# EAGLE design dil_module (EAGLE 5.07)
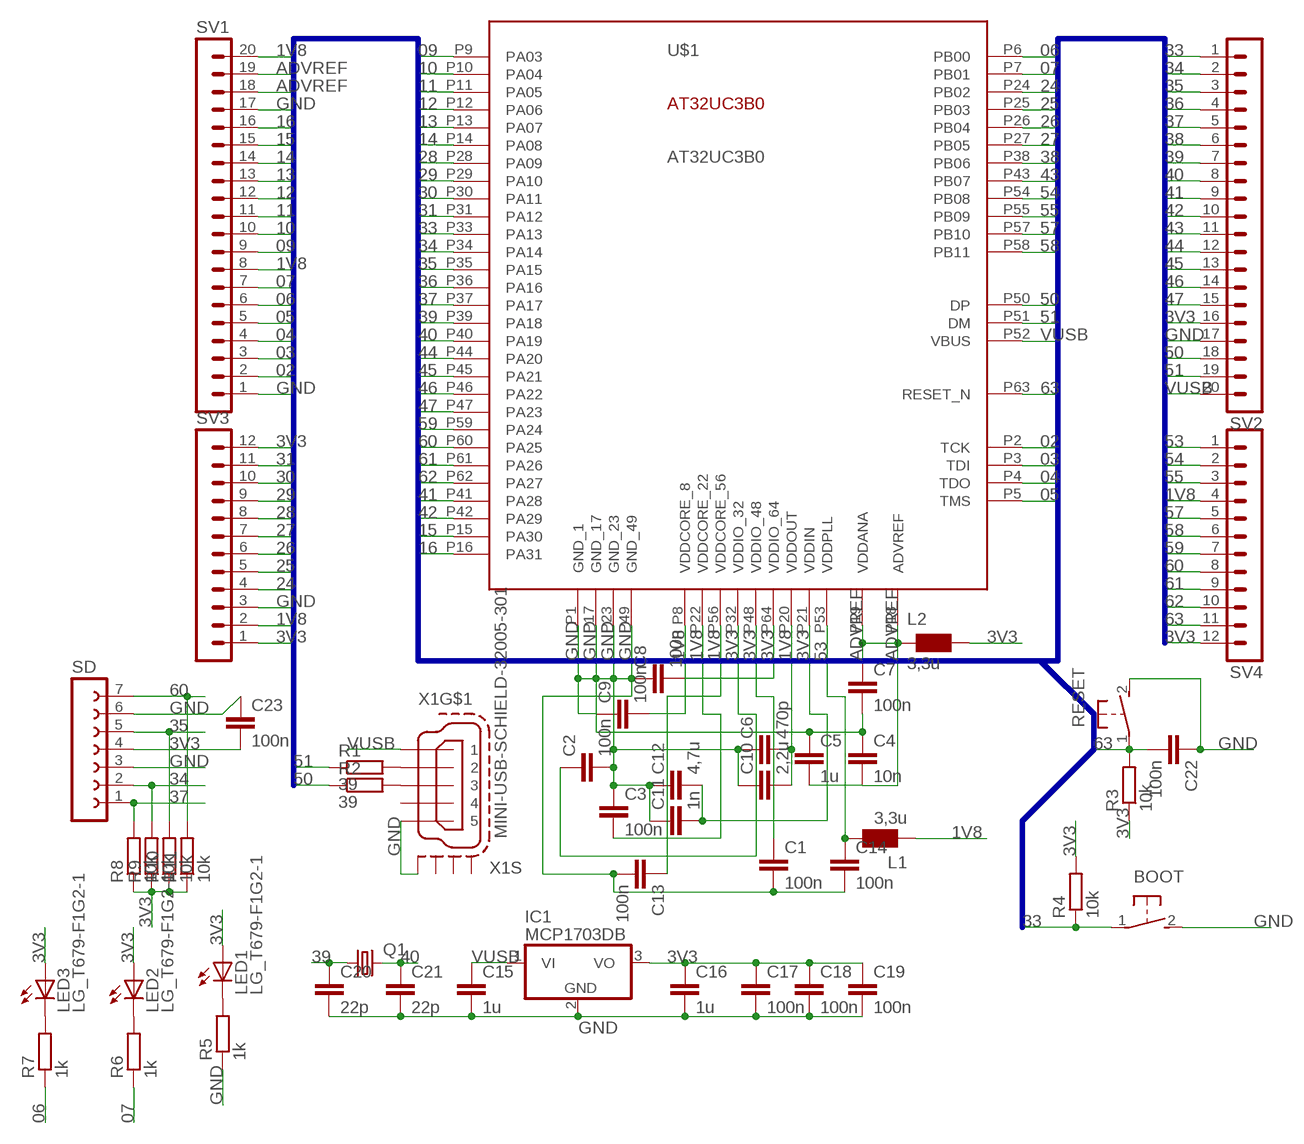
[diagram p0: schematic, sheet 1]

## Parts
BOOT  31-XX  [B3F-31XX]
C1  100n  C-EUC0805  [C0805]
C2  100n  C-EUC0805  [C0805]
C3  100n  C-EUC0805  [C0805]
C4  10n  C-EUC0805  [C0805]
C5  1u  C-EUC0805  [C0805]
C6  470p  C-EUC0805  [C0805]
C7  100n  C-EUC0805  [C0805]
C8  100n  C-EUC0805  [C0805]
C9  100n  C-EUC0805  [C0805]
C10  2,2u  C-EUC1206  [C1206]
C11  1n  C-EUC0805  [C0805]
C12  4,7u  C-EUC1206  [C1206]
C13  100n  C-EUC0805  [C0805]
C14  100n  C-EUC0805  [C0805]
C15  1u  C-EUC0805  [C0805]
C16  1u  C-EUC0805  [C0805]
C17  100n  C-EUC0805  [C0805]
C18  100n  C-EUC0805  [C0805]
C19  100n  C-EUC0805  [C0805]
C20  22p  C-EUC0805  [C0805]
C21  22p  C-EUC0805  [C0805]
C22  100n  C-EUC0805  [C0805]
C23  100n  C-EUC0805  [C0805]
IC1  MCP1703DB  [SOT223]
L1  3,3u  WE-CBF_1206  [1206]
L2  3,3u  WE-CBF_1206  [1206]
LED1  LG_T679-F1G2-1  [PLCC2]
LED2  LG_T679-F1G2-1  [PLCC2]
LED3  LG_T679-F1G2-1  [PLCC2]
Q1  CRYSTALHC49UP  [HC49UP]
R1  39  R-EU_R1206  [R1206]
R2  39  R-EU_R1206  [R1206]
R3  10k  R-EU_R1206  [R1206]
R4  10k  R-EU_R1206  [R1206]
R5  1k  R-EU_R1206  [R1206]
R6  1k  R-EU_R1206  [R1206]
R7  1k  R-EU_R1206  [R1206]
R8  10k  R-EU_R1206  [R1206]
R9  10k  R-EU_R1206  [R1206]
R10  10k  R-EU_R1206  [R1206]
R11  10k  R-EU_R1206  [R1206]
RESET  31-XX  [B3F-31XX]
SD  FE07-1  [FE07]
SV1  MA20-1  [MA20-1]
SV2  MA20-1  [MA20-1]
SV3  MA12-1  [MA12-1]
SV4  MA12-1  [MA12-1]
U$1  AT32UC3B0  [JEDEC_MS-026]
X1  MINI-USB-SCHIELD-32005-301  [32005-301]

## Nets
1V8: C3.2 C6.2 C9.2 C10.2 C13.1 L1.1 SV1.8 SV1.20 SV3.2 SV4.4 U$1.P8(VDDCORE_8) U$1.P20(VDDOUT) U$1.P22(VDDCORE_22) U$1.P56(VDDCORE_56)
02: SV1.2 U$1.P2(TCK)
03: SV1.3 U$1.P3(TDI)
3V3: C1.1 C2.1 C8.2 C11.2 C12.2 C16.1 C17.1 C18.1 C19.1 C23.2 IC1.3(VO) L2.2 LED1.A LED2.A LED3.A R3.1 R4.2 R8.1 R9.1 R10.1 R11.1 SD.4 SV2.16 SV3.1 SV3.12 SV4.12 U$1.P21(VDDIN) U$1.P32(VDDIO_32) U$1.P48(VDDIO_48) U$1.P64(VDDIO_64)
04: SV1.4 U$1.P4(TDO)
05: SV1.5 U$1.P5(TMS)
06: R7.1 SV1.6 U$1.P6(PB00)
07: R6.1 SV1.7 U$1.P7(PB01)
09: SV1.9 U$1.P9(PA03)
10: SV1.10 U$1.P10(PA04)
11: SV1.11 U$1.P11(PA05)
12: SV1.12 U$1.P12(PA06)
13: SV1.13 U$1.P13(PA07)
14: SV1.14 U$1.P14(PA08)
15: SV1.15 U$1.P15(PA30)
16: SV1.16 U$1.P16(PA31)
24: SV3.4 U$1.P24(PB02)
25: SV3.5 U$1.P25(PB03)
26: SV3.6 U$1.P26(PB04)
27: SV3.7 U$1.P27(PB05)
28: SV3.8 U$1.P28(PA09)
29: SV3.9 U$1.P29(PA10)
30: SV3.10 U$1.P30(PA11)
31: SV3.11 U$1.P31(PA12)
33: BOOT.1(P) R4.1 SV2.1 U$1.P33(PA13)
34: R9.2 SD.2 SV2.2 U$1.P34(PA14)
35: R10.2 SD.5 SV2.3 U$1.P35(PA15)
36: SV2.4 U$1.P36(PA16)
37: R8.2 SD.1 SV2.5 U$1.P37(PA17)
38: SV2.6 U$1.P38(PB06)
39: C20.1 Q1.1 SV2.7 U$1.P39(PA18)
40: C21.1 Q1.2 SV2.8 U$1.P40(PA19)
41: SV2.9 U$1.P41(PA28)
42: SV2.10 U$1.P42(PA29)
43: SV2.11 U$1.P43(PB07)
44: SV2.12 U$1.P44(PA20)
45: SV2.13 U$1.P45(PA21)
46: SV2.14 U$1.P46(PA22)
47: SV2.15 U$1.P47(PA23)
50: R2.1 SV2.18 U$1.P50(DP)
51: R1.1 SV2.19 U$1.P51(DM)
53: C14.1 L1.2 SV4.1 U$1.P53(VDDPLL)
54: SV4.2 U$1.P54(PB08)
55: SV4.3 U$1.P55(PB09)
57: SV4.5 U$1.P57(PB10)
58: SV4.6 U$1.P58(PB11)
59: SV4.7 U$1.P59(PA24)
60: R11.2 SD.7 SV4.8 U$1.P60(PA25)
61: SV4.9 U$1.P61(PA26)
62: SV4.10 U$1.P62(PA27)
63: C22.2 R3.2 RESET.1(P) SV4.11 U$1.P63(RESET_N)
ADVREF: C4.2 C5.2 C7.1 L2.1 SV1.18 SV1.19 U$1.P18(ADVREF) U$1.P19(VDDANA)
GND: BOOT.2(S) C1.2 C2.2 C3.1 C4.1 C5.1 C6.1 C7.2 C8.1 C9.1 C10.1 C11.1 C12.1 C13.2 C14.2 C15.2 C16.2 C17.2 C18.2 C19.2 C20.2 C21.2 C22.1 C23.1 IC1.2(GND) R5.1 RESET.2(S) SD.3 SD.6 SV1.1 SV1.17 SV2.17 SV3.3 U$1.P1(GND_1) U$1.P17(GND_17) U$1.P23(GND_23) U$1.P49(GND_49) X1.5 X1.M1(S:S1)
N$1: LED1.C R5.2
N$2: R1.2 X1.2
N$3: R2.2 X1.3
N$4: LED2.C R6.2
N$5: LED3.C R7.2
VUSB: C15.1 IC1.1(VI) SV2.20 U$1.P52(VBUS) X1.1
Unconnected: X1.4 X1.M2(S:S2) X1.M3(S:S3) X1.M4(S:S4)

## Buses
B$1

## Library data of the parts
BOOT RESET = switch-omron:31-XX: OMRON SWITCH
C1-C23 = rcl:C-EU: CAPACITOR, European symbol
IC1 = linear:MCP1703: 250 mA, 16V, Low Quiescent Current LDO Regulator Source: http://ww1.microchip.com/downloads/en/DeviceDoc/22049b.pdf
L1 L2 = wuerth-elektronik:WE-CBF: SMD EMI Suppression Ferrite Beads - excellent anti-EMI properties - low DCR - impedances till 3000 ohms - rated current up to 6 A
LED1-LED3 = led:*_T679-?-1: LC TOPLED® Low Current LED Source: http://catalog.osram-os.com .. LG_LS_LY_T679_OBS.pdf; COLOR: green
Q1 = crystal:CRYSTAL: CRYSTAL
R1-R11 = rcl:R-EU_: RESISTOR, European symbol
SD = con-lsta:FE07-1: FEMALE HEADER
SV1 SV2 = con-lstb:MA20-1: PIN HEADER
SV3 SV4 = con-lstb:MA12-1: PIN HEADER
U$1 = UC3Bxxxx:AT32UC3B0: The AT32UC3B is a complete System-On-Chip microcontroller based on the AVR32 UC RISC processor running at frequencies up to 60 MHz. AVR32 UC is a high-performance 32-bit RISC microprocessor core, designed for cost-sensitive embedded applications, with particular empha- sis on low power consumption, high code density and high performance.
X1 = con-cypressindustries:MINI-USB-SCHIELD-: MINI USB-B Conector Source: www.cypressindustries.com

## Board
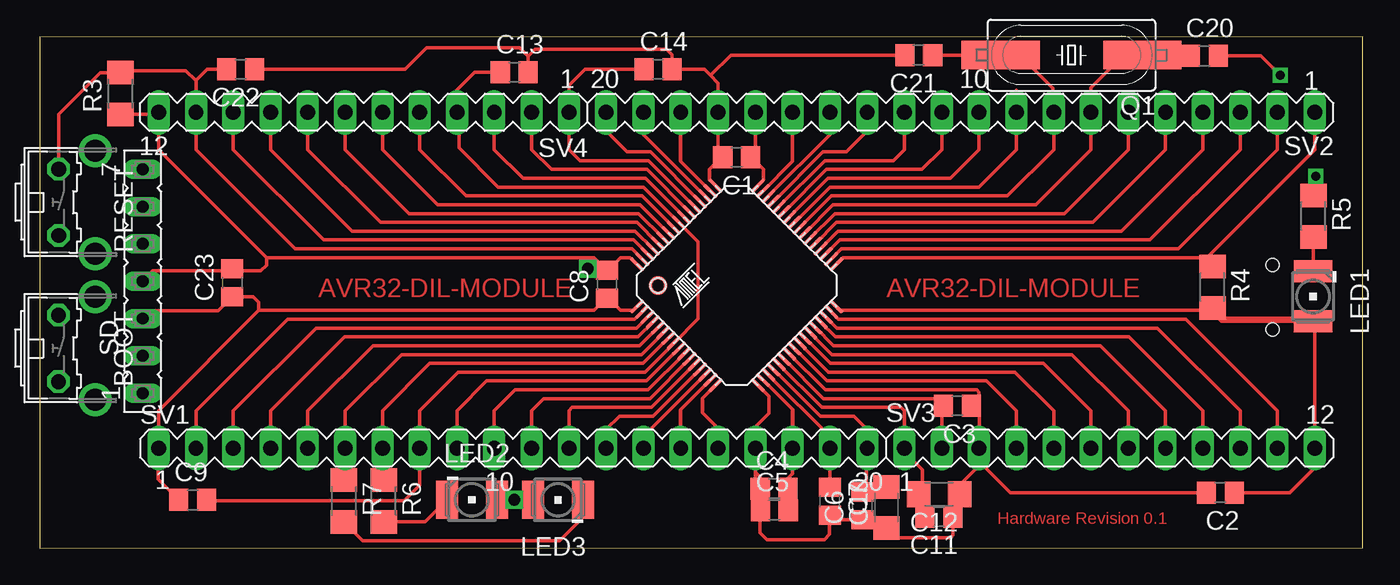
[diagram p1: board, top side]
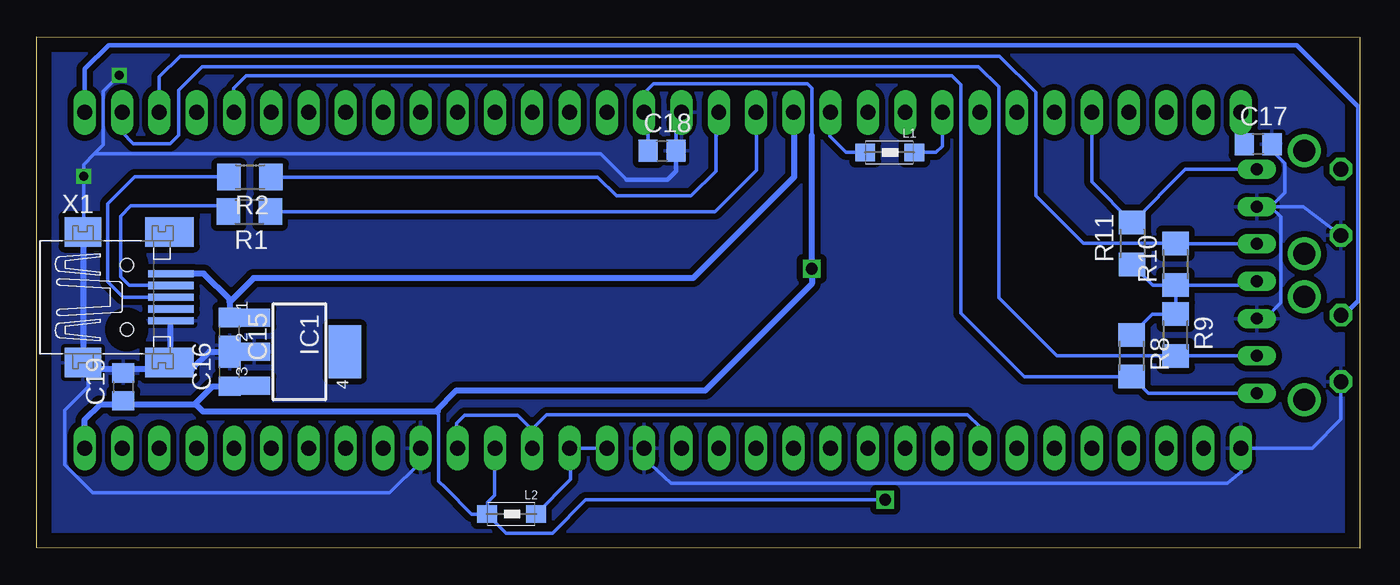
[diagram p2: board, bottom side, seen from below]

Size 90.11 x 34.81 mm. Coordinates in mm from the lower left corner, seen from the top.
Outline: 0,0 90.11,0.03 90.11,34.81 0,34.79 0,0
Copper layers (1*16): Top 0.035mm / dielectric 1.5mm / Bottom 0.035mm
Design rules "default": minimum track width 10mil, minimum drill 24mil, track to track 8mil, track to pad 8mil, pad to pad 8mil, via to via 8mil, smd to smd 8mil, copper to edge 40mil, drill to drill 8mil, minimum pad ring 10mil, minimum via ring 8mil, stop-mask expansion 4mil, vias tented up to drill 0mil, thermal gap 10mil

### Footprints (pad centres in the part's own frame; a part is rotated, then mirrored left to right if it is on the bottom)
B3F-31XX = drill 1.016 octagon: 1 -2.261,-1.245; 2 2.261,-1.245 | drill 1.499 pad 2.159 round: 3 -3.505,1.245; 4 3.505,1.245
C0805 = smd 1.3 x 1.5: 1 -0.95,0; 2 0.95,0
C1206 = smd 1.6 x 1.8: 1 -1.4,0; 2 1.4,0
SOT223 = smd 1.219 x 2.235: 1 -2.311,-3.099; 2 0,-3.099; 3 2.311,-3.099 | smd 3.6 x 2.2: 4 0,3.099
1206 = smd 1.35 x 1.2: 1 -1.7,0; 2 1.65,0
PLCC2 = smd 2.6 x 1.5: A 0,1.7; C 0,-1.7
HC49UP = smd 5.334 x 1.93: 1 -4.826,0; 2 4.826,0
R1206 = smd 1.6 x 1.803: 1 -1.422,0; 2 1.422,0
FE07 = drill 0.813 long: 1 -7.62,0; 2 -5.08,0; 3 -2.54,0; 4 0,0; 5 2.54,0; 6 5.08,0; 7 7.62,0
MA20-1 = drill 1.016 long: 1 -24.13,0; 2 -21.59,0; 3 -19.05,0; 4 -16.51,0; 5 -13.97,0; 6 -11.43,0; 7 -8.89,0; 8 -6.35,0; 9 -3.81,0; 10 -1.27,0; 11 1.27,0; 12 3.81,0; 13 6.35,0; 14 8.89,0; 15 11.43,0; 16 13.97,0; 17 16.51,0; 18 19.05,0; 19 21.59,0; 20 24.13,0
MA12-1 = drill 1.016 long: 1 -13.97,0; 2 -11.43,0; 3 -8.89,0; 4 -6.35,0; 5 -3.81,0; 6 -1.27,0; 7 1.27,0; 8 3.81,0; 9 6.35,0; 10 8.89,0; 11 11.43,0; 12 13.97,0
JEDEC_MS-026 = smd 1.2 x 0.27: P1 -6.06,3.535; P2 -6.06,3.03; P3 -6.06,2.525; P4 -6.06,2.02; P5 -6.06,1.515; P6 -6.06,1.01; P7 -6.06,0.505; P8 -6.06,0; P9 -6.06,-0.505; P10 -6.06,-1.01; P11 -6.06,-1.515; P12 -6.06,-2.02; P13 -6.06,-2.525; P14 -6.06,-3.03; P15 -6.06,-3.535; P16 -6.06,-4.04; P33 5.555,-4.04; P34 5.555,-3.535; P35 5.555,-3.03; P36 5.555,-2.525; P37 5.555,-2.02; P38 5.555,-1.515; P39 5.555,-1.01; P40 5.555,-0.505; P41 5.555,0; P42 5.555,0.505; P43 5.555,1.01; P44 5.555,1.515; P45 5.555,2.02; P46 5.555,2.525; P47 5.555,3.03; P48 5.555,3.535 | smd 0.27 x 1.2: P17 -4.04,-6.06; P18 -3.535,-6.06; P19 -3.03,-6.06; P20 -2.525,-6.06; P21 -2.02,-6.06; P22 -1.515,-6.06; P23 -1.01,-6.06; P24 -0.505,-6.06; P25 0,-6.06; P26 0.505,-6.06; P27 1.01,-6.06; P28 1.515,-6.06; P29 2.02,-6.06; P30 2.525,-6.06; P31 3.03,-6.06; P32 3.535,-6.06; P49 3.535,5.555; P50 3.03,5.555; P51 2.525,5.555; P52 2.02,5.555; P53 1.515,5.555; P54 1.01,5.555; P55 0.505,5.555; P56 0,5.555; P57 -0.505,5.555; P58 -1.01,5.555; P59 -1.515,5.555; P60 -2.02,5.555; P61 -2.525,5.555; P62 -3.03,5.555; P63 -3.535,5.555; P64 -4.04,5.555
32005-301 = smd 3.1 x 0.5: 1 3,1.6; 2 3,0.8; 3 3,0; 4 3,-0.8; 5 3,-1.6 | smd 2.5 x 2: M1 -3,-4.45; M2 -3,4.45 | smd 3.3 x 2: M3 2.9,4.45; M4 2.9,-4.45 | hole 0.9: 0,2.2; 0,-2.2

### Placement (x,y rotation side)
BOOT  2.52,13.6 270 top
C1  47.47,26.6 180 top
C2  80.4,3.78 180 top
C3  62.5,9.69 180 top
C4  50.02,4.05 0 top
C5  50.03,2.58 0 top
C6  56.02,2.87 90 top
C7  53.81,3.19 270 top
C8  38.64,17.95 90 top
C9  10.42,3.27 0 top
C10  57.67,2.77 90 top
C11  61.25,2.13 180 top
C12  61.25,3.66 180 top
C13  32.32,32.39 0 top
C14  42.12,32.59 0 top
C15  76.98,14.74 270 bottom
C16  76.98,11.96 90 bottom
C17  6.92,27.5 0 bottom
C18  47.52,27.04 0 bottom
C19  84.21,10.97 90 bottom
C20  79.32,33.5 0 top
C21  59.87,33.56 180 top
C22  13.69,32.6 180 top
C23  13.11,18.05 90 top
IC1  72.22,13.37 270 bottom
L1  32.03,26.93 180 bottom
L2  57.8,2.31 180 bottom
LED1  86.73,17.13 180 top
LED2  29.44,3.29 270 top
LED3  35.3,3.28 90 top
Q1  70.27,33.56 180 top
R1  75.63,22.9 180 bottom
R2  75.58,25.26 180 bottom
R3  5.49,30.94 90 top
R4  79.87,17.76 270 top
R5  86.75,22.6 270 top
R6  23.43,3.2 270 top
R7  20.72,3.2 270 top
R8  15.53,13.09 270 bottom
R9  12.54,14.5 270 bottom
R10  12.55,19.33 90 bottom
R11  15.5,20.74 90 bottom
RESET  2.53,23.54 270 top
SD  7.01,18.17 90 top
SV1  32.23,6.8 0 top
SV2  62.71,29.66 180 top
SV3  72.87,6.8 0 top
SV4  22.07,29.66 180 top
U$1  47.47,18.23 45 top
X1  83.97,17.08 0 bottom

### Tracks (layer width: path | path; a pad name or v marks a point on that pad's centre or on a via)
1V8  (via drill 0.6)
  Top 0: 56.38,8.15 56.38,6.78 v56.37,6.76 | 56.34,8.14 56.34,6.78 v56.35,6.76
  Top 0.254: C10.2 57.83,4.01 57.88,3.96 56.16,3.96 C6.2 56.31,4.11 56.31,6.76 SV1.20 | SV1.20 56.36,8.15 | SV1.8 25.92,6.77 | SV4.4 28.44,29.65 | SV4.4 28.38,29.71 28.38,31.15 29.62,32.39 C13.1 | U$1.P8 44.84,15.6 44.84,20.87 U$1.P56 | U$1.P8 | U$1.P56 | U$1.P20 53.16,8.97 55.45,8.97 56.35,8.07 56.35,6.81 SV1.20 | SV3.2 61.44,9.58 C3.2 61.55,9.78 61.15,10.17 53.39,10.17 U$1.P22 | U$1.P8 41.21,11.97 28.51,11.97 25.88,9.34 SV1.8 | U$1.P56 41.13,24.57 31.23,24.57 28.55,27.25 28.55,29.54 SV4.4 | SV1.8 25.88,4.26 24.83,3.21 11.44,3.21 C9.2
  Bottom 0.254: 61.5,6.74 SV3.2 61.52,6.88 61.52,8.48 60.96,9.04 57.35,9.04 56.37,8.05 v56.37,6.76 SV1.20 | SV1.8 25.88,8.25 26.72,9.09 55.39,9.09 56.35,8.13 56.35,6.81 SV1.20 | L1.1 28.87,26.93 28.44,27.36 28.44,29.65 SV4.4 | SV1.20 v56.35,6.76
02
  Top 0.254: U$1.P2 40.52,15.57 16.87,15.57 10.64,9.34 SV1.2
03
  Top 0.254: U$1.P3 40.64,14.97 18.81,14.97 13.18,9.34 SV1.3
3V3  (via drill 0.6, 0.8)
  Top 0: 79.98,15.64 80.28,15.64 80.5,15.64 80.52,15.63 80.57,15.63 | v86.81,6.79 86.89,6.87 | 48.9,24.69 U$1.P48 | 48.9,24.69 49.28,25.08 49.28,25.73 49.3,25.75 49.27,25.75 C1.1 | 48.9,24.69 48.91,24.69 49.28,25.07 49.28,25.74 49.31,25.77 49.22,25.77 48.97,26.02 48.75,26.02 48.43,26.35 48.43,27 48.75,27.33 48.75,29.65 v48.74,29.67
  Top 0.254: 48.74,26.59 48.74,26.35 49.31,25.78 49.31,25.07 U$1.P48 | 48.74,26.59 SV2.16 | 48.74,26.59 48.44,26.59 | C2.1 85.15,3.78 86.8,5.42 86.8,6.76 SV3.12 86.84,15.69 86.78,15.64 79.98,15.64 79.87,15.75 | R3.1 7.95,29.52 SV4.12 8.09,27.12 15.44,19.77 | 79.87,15.75 R4.2 | LED1.A 80.49,15.43 80.28,15.64 | U$1.P32 54.28,16.45 54.55,16.17 79.44,16.17 79.87,15.75 | 38.95,19.17 38.68,18.9 C8.2 | U$1.P64 40.22,19.77 39.55,19.77 38.95,19.17 | 38.35,19.17 38.95,19.17 | 38.35,19.17 37.75,19.77 15.44,19.77 | C11.2 C12.2 59.94,3.66 60.12,3.84 60.12,5.34 58.9,6.56 SV3.1 58.9,9.34 58.67,9.57 53.27,9.57 U$1.P21 | LED2.A LED3.A v32.32,3.28 | SD.4 7.12,18.06 | 15.44,19.77 15.44,19.26 15.04,18.86 13.25,18.86 | 13.25,18.86 C23.2 | v7.01,18.17 7.7,18.86 13.25,18.86 | 38.35,19.17 38.19,19.01 v37.32,19.01
  Bottom 0: v86.81,6.79 86.81,8.56 86.89,8.64 86.89,8.66 85.83,9.71 79.43,9.71 79.36,9.78 | 62.28,4.1 62.72,4.54 | R11.1 14.11,17.93 14.07,17.93 14.06,17.92 7.29,17.92 7.03,18.17 v7.01,18.17
  Bottom 0.254: C16.1 75.41,11.15 IC1.3 | 48.74,28.88 v48.74,29.67 48.74,30.95 48.09,31.59 37.6,31.59 37.3,31.29 37.31,31.28 37.31,28.1 | 7.99,29.78 SV4.12 7.87,29.44 C17.1 | C19.1 84.21,9.87 84.31,9.76 | C18.1 48.47,29.4 SV2.16 48.69,29.71 | 79.36,9.78 79.36,9.77 79.37,9.76 | L2.2 60.49,2.31 62.28,4.1 62.73,4.55 62.73,9.11 62.77,9.15 62.81,9.15 62.69,9.26 62.69,9.54 61.54,10.69 61.54,10.71 | v32.32,3.28 52.73,3.28 54.99,1.02 58.16,1.02 L2.2 | L2.2 59.41,2.35 59.41,3.12 58.94,3.59 58.94,6.76 SV3.1 | R11.1 14.08,17.91 R10.1 | R10.1 12.54,17.9 R9.1 14.12,15.92 R8.1 | R10.1 7.27,17.91 SD.4
  Bottom 0.406: C16.1 78.12,11.01 79.37,9.76 84.31,9.76 85.84,9.76 86.87,8.73 86.87,6.84 SV3.12 | 79.36,9.78 79.28,9.78 78.79,9.29 62.96,9.29 61.54,10.71 44.59,10.71 37.32,17.98 v37.32,19.01 37.32,19.1 37.32,28.09 37.31,28.1 | 8.1,29.12 8.12,29.14 8.12,29.64 SV4.12
04
  Top 0.254: U$1.P4 40.75,14.37 20.75,14.37 15.72,9.34 SV1.4
05
  Top 0.254: U$1.P5 40.87,13.77 22.69,13.77 18.26,9.34 SV1.5
06
  Top 0.254: U$1.P6 40.98,13.17 24.63,13.17 20.8,9.34 SV1.6 20.8,4.32 R7.1
07
  Top 0.254: U$1.P7 41.1,12.57 26.57,12.57 23.34,9.34 SV1.7 23.34,4.23 R6.1
09
  Top 0.254: U$1.P9 41.32,11.37 30.45,11.37 28.42,9.34 SV1.9
10
  Top 0.254: U$1.P10 41.44,10.77 32.39,10.77 30.96,9.34 SV1.10
11
  Top 0.254: U$1.P11 41.55,10.17 34.33,10.17 33.5,9.34 SV1.11
12
  Top 0.254: U$1.P12 41.67,9.57 36.27,9.57 36.04,9.34 SV1.12
13
  Top 0.254: U$1.P13 41.78,8.97 39.48,8.97 38.58,8.07 SV1.13
14
  Top 0.254: U$1.P14 41.12,7.6 SV1.14
15
  Top 0.254: U$1.P15 43.66,9.43 SV1.15
16
  Top 0.254: U$1.P16 45.13,10.18 45.13,9.21 46.2,8.15 SV1.16
24
  Top 0.254: U$1.P24 53.62,11.37 64.49,11.37 66.52,9.34 SV3.4
25
  Top 0.254: U$1.P25 53.73,11.97 66.43,11.97 69.06,9.34 SV3.5
26
  Top 0.254: U$1.P26 53.84,12.57 68.37,12.57 71.6,9.34 SV3.6
27
  Top 0.254: U$1.P27 53.96,13.17 70.31,13.17 74.14,9.34 SV3.7
28
  Top 0.254: U$1.P28 54.07,13.77 72.25,13.77 76.68,9.34 SV3.8
29
  Top 0.254: U$1.P29 54.19,14.37 74.19,14.37 79.22,9.34 SV3.9
30
  Top 0.254: U$1.P30 54.3,14.97 76.13,14.97 81.76,9.34 SV3.10
31
  Top 0.254: U$1.P31 54.41,15.57 78.07,15.57 84.3,9.34 SV3.11
33
  Top 0.254: U$1.P33 54.72,19.77 79.27,19.77 79.38,19.66 | 79.38,19.66 R4.1 | SV2.1 86.84,27.12 79.38,19.66
  Bottom 0.305: SV2.1 86.83,29.67 86.83,32.63 85.23,34.23 4.29,34.23 0.1,30.04 0.1,16.83 1.08,15.86 BOOT.1
34
  Top 0.254: U$1.P34 54.61,20.37 77.55,20.37 84.3,27.12 SV2.2
  Bottom 0.254: SD.2 R9.2 20.49,13.08 | 20.49,13.08 20.5,13.07 | 20.49,13.08 20.62,13.08 24.6,17.05 24.6,31.41 25.96,32.78 78.84,32.78 80.46,31.16 80.46,28.11 81.03,27.54 83.54,27.54 84.3,28.3 SV2.2
35
  Top 0.254: U$1.P35 54.49,20.97 75.61,20.97 81.76,27.12 SV2.3
  Bottom 0.254: SD.5 12.51,20.71 R10.2 18.82,20.75 22.06,23.99 22.06,31.02 24.53,33.49 80.36,33.49 81.77,32.07 81.77,29.68 SV2.3
36
  Top 0.254: U$1.P36 54.38,21.57 73.67,21.57 79.22,27.12 SV2.4
37
  Top 0.254: U$1.P37 54.27,22.17 71.73,22.17 76.68,27.12 SV2.5
  Bottom 0.254: SD.1 14.41,10.55 R8.2 22.86,11.67 27.16,15.97 27.16,31.53 27.77,32.14 75.84,32.14 76.69,31.3 76.69,29.68 SV2.5
38
  Top 0.254: U$1.P38 54.15,22.77 69.79,22.77 74.14,27.12 SV2.6
39
  Top 0.254: C20.1 77.12,33.54 Q1.1 73.81,33.56 71.6,31.35 SV2.7 71.6,27.12 67.85,23.37 54.04,23.37 U$1.P39
40
  Top 0.254: U$1.P40 53.92,23.97 65.91,23.97 69.06,27.12 SV2.8 69.01,29.71 69.01,31.31 66.76,33.56 Q1.2 60.84,33.54 C21.1
41
  Top 0.254: 66.52,31.16 SV2.9 66.52,27.12 63.97,24.57 53.81,24.57 U$1.P41
42
  Top 0.254: U$1.P42 53.7,25.17 62.03,25.17 63.98,27.12 SV2.10
43
  Top 0.254: U$1.P43 53.58,25.77 60.09,25.77 61.44,27.12 SV2.11
44
  Top 0.254: U$1.P44 53.47,26.37 58.15,26.37 58.9,27.12 SV2.12
45
  Top 0.254: U$1.P45 53.35,26.97 54.94,26.97 56.36,28.39 SV2.13
46
  Top 0.254: U$1.P46 53.82,28.16 SV2.14
47
  Top 0.254: U$1.P47 51.28,26.33 SV2.15
50
  Top 0.254: U$1.P50 43.66,26.33 SV2.18
  Bottom 0.254: 43.81,28.57 43.81,28.07 | 43.81,28.57 43.81,29.52 SV2.18 | R2.1 51.91,25.26 50.63,23.98 45.53,23.98 43.85,25.67 43.85,28.53 43.81,28.57
51
  Top 0.254: 41.09,29.64 SV2.19 41.12,28.16 U$1.P51
  Bottom 0.254: 41.09,28.4 41.09,29.64 SV2.19 41.09,29.63 41.09,25.71 43.9,22.9 R1.1
53
  Top 0.254: C14.1 37.14,32.59 36.05,31.5 SV4.1 36.04,27.12 36.79,26.37 41.47,26.37 U$1.P53
  Bottom 0.254: L1.2 35,26.93 36.08,28.02 36.08,29.62 SV4.1
54
  Top 0.254: U$1.P54 41.36,25.77 34.85,25.77 33.5,27.12 SV4.2
55
  Top 0.254: U$1.P55 41.24,25.17 32.91,25.17 30.96,27.12 SV4.3
57
  Top 0.254: U$1.P57 41.02,23.97 29.03,23.97 25.88,27.12 SV4.5
58
  Top 0.254: U$1.P58 40.9,23.37 27.09,23.37 23.34,27.12 SV4.6
59
  Top 0.254: U$1.P59 40.79,22.77 25.15,22.77 20.8,27.12 SV4.7
60
  Top 0.254: U$1.P60 40.67,22.17 23.21,22.17 18.26,27.12 SV4.8
  Bottom 0.254: 18.28,29.65 SV4.8 18.26,24.92 R11.2 11.88,25.79 SD.7
61
  Top 0.254: U$1.P61 40.56,21.57 21.27,21.57 15.72,27.12 SV4.9
62
  Top 0.254: U$1.P62 40.44,20.97 19.33,20.97 13.18,27.12 SV4.10
63
  Top 0.254: 10.64,31.84 SV4.11 10.64,27.12 17.39,20.37 40.33,20.37 U$1.P63 | 10.64,31.84 11.42,32.62 12.72,32.62 C22.2 | 10.64,31.84 10.61,31.84 9.95,32.5 5.63,32.5 R3.2 4.11,32.36 1.29,29.54 RESET.1
ADVREF  (via drill 0.8)
  Top 0: U$1.P19 53.74,7.68 v53.74,6.81
  Top 0.254: C5.2 C4.2 | C4.2 | SV1.18 51.3,6.79 51.3,9.41 U$1.P18 | SV1.18 51.28,9.43 | C7.1 53.79,6.78 SV1.19 53.82,7.6 U$1.P19 | C4.2 50.98,4.74 51.28,5.04 SV1.18
  Bottom 0.254: SV1.18 v53.74,6.8 v53.74,6.81 53.74,4.67 L2.1
GND  (via drill 0.6)
  Top 0: U$1.P17 49.62,10.36 49.62,9.21 49.65,9.17 49.65,9.14 48.76,8.25 48.76,6.74 v48.78,6.71 | U$1.P49 46,24.66 45.63,25.03 | 45.63,25.03 45.59,25.07 45.59,25.84 46.31,26.57 46.31,27.11 46.15,27.27 46.15,29.61 v46.17,29.62 | C2.2 66.13,3.78 65.95,3.95 65.95,3.96 64,5.92 64,6.74 v63.98,6.76 | 45.63,25.03 45.63,25.79 46.37,26.53 46.44,26.53 46.21,26.76 46.21,27.37 46.18,27.41 v46.18,29.63
  Top 0.254: 49.08,3.52 C4.1 48.76,4.36 48.76,5.18 | 49.08,3.52 C5.1 49.07,1.04 49.55,0.57 53.44,0.57 53.79,0.92 C7.2 54.13,1.92 C6.1 | 62.2,3.66 C11.1 62.2,0.87 62.05,0.71 57.81,0.71 C10.1 57.12,1.92 C6.1 | 62.2,3.66 C12.1 | 33.26,33.48 33.75,33.97 42.7,33.97 43.07,33.6 C14.2 45.26,32.59 45.68,32.18 | 33.26,33.48 33.26,32.41 C13.2 | SV1.1 8.08,6.82 | SV1.1 8.08,6.78 8.08,4.67 C9.1 | 48.76,5.18 49.07,4.87 | 48.76,5.18 48.76,6.78 SV1.17 48.74,8.25 49.67,9.18 49.67,10.32 U$1.P17 | 63.97,5.91 63.97,5.61 62.2,3.84 62.2,3.66 | 63.97,5.91 SV3.3 | 63.97,5.91 66.11,3.78 C2.2 | 46.2,26.61 46.2,26.37 45.61,25.79 45.61,25.09 U$1.P49 | 46.2,26.61 46.2,28.57 | 46.2,28.57 SV2.17 | 46.2,26.61 C1.2 | 45.68,32.18 46.21,31.65 46.21,28.58 46.2,28.57 | C21.2 47.07,33.56 45.68,32.18 | C22.1 24.87,32.6 26.34,34.07 32.67,34.07 33.26,33.48 | 49.08,3.52 48.81,3.25 | U$1.P23 53.5,10.77 63.82,10.77 63.98,10.61 63.98,10.22 C3.1 64,9.13 v64,6.82 | 38.95,16.77 38.72,17 C8.1 | U$1.P1 40.41,16.17 39.55,16.17 38.95,16.77 | 38.95,16.77 38.35,16.77 37.75,16.17 14.92,16.17 | 14.92,16.17 8.09,9.34 8.09,6.81 SV1.1 | C6.1 55.74,2.2 | C20.2 83.18,33.5 v84.49,32.19 | R5.1 86.75,25.14 v86.92,25.31 | SD.3 7.54,16.16 12.16,16.16 C23.1 13.12,17.1 14.54,17.1 14.92,16.72 14.92,16.17
  Bottom 0: v46.18,29.63 46.57,29.24 46.57,27.02
  Bottom 0.254: v48.78,6.71 48.78,6.16 46.9,4.42 9.02,4.42 8.08,5.19 8.08,6.28 | 8.08,6.28 8.08,6.78 8.06,6.8 3.24,6.8 1.28,8.77 BOOT.2 | SV3.3 v64,6.82 | C16.2 75.64,13.05 IC1.2 76.55,13.37 76.63,13.45 C15.2 | 86.19,26.83 86.92,26.1 v86.92,25.31 86.92,21.58 | 86.19,26.83 85.57,27.44 85.57,31.11 v84.49,32.19 | 80.97,12.2 80.97,12.53 | v63.98,6.76 63.98,5.83 66.06,3.75 86.29,3.75 88.21,5.66 88.21,9.39 86.62,10.98 86.62,12.13 86.55,12.2 | C19.2 84.21,12.1 84.11,12.2 | C18.2 46.57,29.22 v46.17,29.62 | 49.95,25.06 51.71,26.83 86.19,26.83 | SD.6 3.83,23.25 RESET.2 | SD.6 6.05,23.25 5.12,24.18 5.12,26.21 5.86,26.95 5.86,27.38 C17.2 | SD.6 6.08,23.25 5.38,22.55 5.38,16.7 6.44,15.63 SD.3 | 8.08,6.28 8.1,6.3 SV1.1
  Bottom 0.305: 46.57,27.02 46.58,27.01 46.58,25.64 47.16,25.06 49.95,25.06
  Bottom 0.406: 80.97,12.2 X1.5 | 80.97,12.2 79.52,12.2 78.34,13.38 76.7,13.38 76.63,13.45 | 80.97,12.2 84.11,12.2 86.55,12.2 X1.M1 86.92,12.68 86.92,21.58
  pour Bottom (isolate 0.406): -0.08,34.81 90.19,34.81 90.19,-0.06 -0.08,-0.06
N$1
  Top 0.254: R5.2 86.75,18.86 LED1.C
N$2
  Bottom 0.254: X1.2 83.81,17.88 84.4,18.47 84.4,22.59 83.7,23.29 77.45,23.29 R1.2
N$3
  Bottom 0.254: X1.3 84.23,17.08 85.27,18.12 85.27,23.46 83.45,25.27 77.02,25.27 R2.2
N$4
  Top 0.254: LED2.C 26.24,1.78 R6.2
N$5
  Top 0.254: 37.06,3.21 LED3.C 37,2.1 35.4,0.5 22,0.5 R7.2
VUSB  (via drill 0.8)
  Top 0.254: U$1.P52 41.59,26.97 40,26.97 38.58,28.39 SV2.20 v38.58,29.67 | v38.58,29.67
  Bottom 0.254: IC1.1 76.96,15.68 C15.1
  Bottom 0.406: C15.1 76.98,16.74 | 76.98,16.74 76.98,16.93 78.73,18.68 X1.1 | 76.98,16.74 75.34,18.37 45.41,18.37 38.51,25.28 38.51,29.59 SV2.20
(copper drawn outside any net)
  shapes: Top circle x1

### Text on the board
Top: AVR32-DIL-MODULE | AVR32-DIL-MODULE | Hardware Revision 0.1